# Altium schematic sheet MLX.SchDoc
size A4
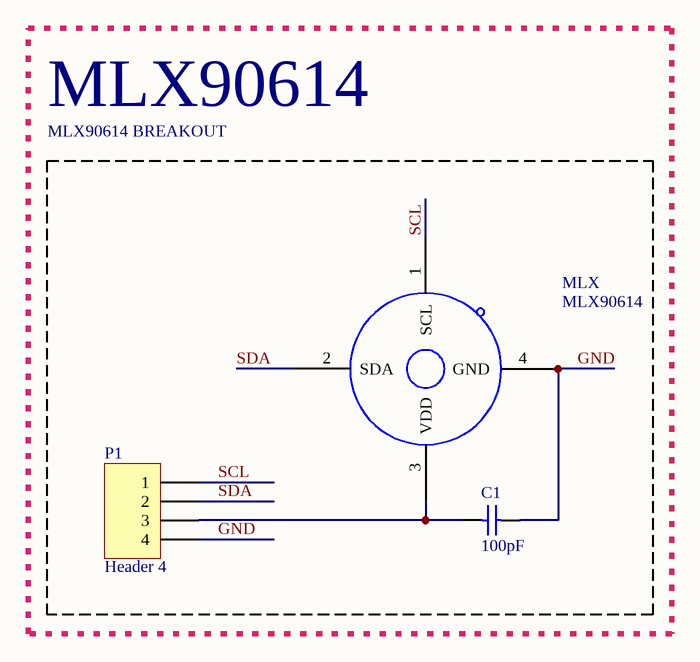
[diagram p0: MLX.SchDoc]

## Parts
C1  value 100pF  [C1206]  (hidden comment: Cap Semi)
MLX  MLX90614  [MLX90614]
P1  Header 4  [HDR1X4]

## Blocks framed on the sheet
MLX90614 BREAKOUT: C1 MLX P1

## Nets
GND: C1.1 MLX.4(GND) P1.4
SCL: MLX.1(SCL) P1.1
SDA: MLX.2(SDA) P1.2
NetC1_2: C1.2 MLX.3(VDD) P1.3

## Notes on the sheet
- MLX90614

## Library data of the parts
C1 = Cap Semi: Capacitor (Semiconductor SIM Model); Published: 8-Jun-2000; LatestRevisionDate: 29-May-2009; LatestRevisionNote: IPC-7351 Footprint Added.; PackageReference: C1206; Publisher: Altium Limited; PackageDescription: Chip Capacitor
P1 = Header 4: Header, 4-Pin; LatestRevisionDate: 17-Jul-2002; LatestRevisionNote: Re-released for DXP Platform.; Publisher: Altium Limited